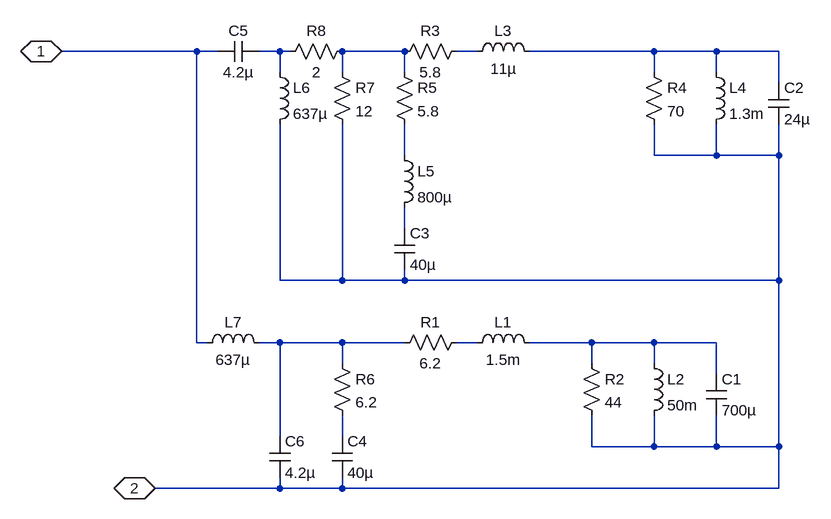
[diagram p0: schematic model_2way_speaker.asc]
model_2way_speaker.asc, the LTspice schematic file:
Version 4
SHEET 1 880 680
WIRE -544 -256 -752 -256
WIRE -512 -256 -544 -256
WIRE -416 -256 -448 -256
WIRE -400 -256 -416 -256
WIRE -224 -256 -320 -256
WIRE -112 -256 -144 -256
WIRE 160 -256 -32 -256
WIRE 256 -256 160 -256
WIRE 352 -256 256 -256
WIRE -416 -224 -416 -256
WIRE -320 -224 -320 -256
WIRE -224 -224 -224 -256
WIRE 160 -224 160 -256
WIRE 256 -224 256 -256
WIRE 352 -208 352 -256
WIRE -224 -96 -224 -144
WIRE 160 -96 160 -144
WIRE 256 -96 256 -144
WIRE 256 -96 160 -96
WIRE 352 -96 352 -144
WIRE 352 -96 256 -96
WIRE -224 16 -224 -16
WIRE -416 96 -416 -144
WIRE -320 96 -320 -144
WIRE -320 96 -416 96
WIRE -224 96 -224 80
WIRE -224 96 -320 96
WIRE 352 96 352 -96
WIRE 352 96 -224 96
WIRE -544 192 -544 -256
WIRE -528 192 -544 192
WIRE -416 192 -448 192
WIRE -320 192 -416 192
WIRE -224 192 -320 192
WIRE -112 192 -144 192
WIRE 64 192 -32 192
WIRE 160 192 64 192
WIRE 256 192 160 192
WIRE -320 224 -320 192
WIRE 64 224 64 192
WIRE 160 224 160 192
WIRE 256 240 256 192
WIRE -416 336 -416 192
WIRE -320 336 -320 304
WIRE 64 352 64 304
WIRE 160 352 160 304
WIRE 160 352 64 352
WIRE 256 352 256 304
WIRE 256 352 160 352
WIRE 352 352 352 96
WIRE 352 352 256 352
WIRE -416 416 -416 400
WIRE -416 416 -608 416
WIRE -320 416 -320 400
WIRE -320 416 -416 416
WIRE 352 416 352 352
WIRE 352 416 -320 416
FLAG -752 -256 1
IOPIN -752 -256 BiDir
FLAG -608 416 2
IOPIN -608 416 BiDir
SYMBOL res -128 176 R90
WINDOW 0 0 56 VBottom 0
WINDOW 3 32 56 VTop 0
SYMATTR InstName R1
SYMATTR Value 6.2
SYMBOL ind -128 208 R270
WINDOW 0 32 56 VTop 0
WINDOW 3 5 56 VBottom 0
SYMATTR InstName L1
SYMATTR Value 1.5m
SYMBOL res 48 208 R0
SYMATTR InstName R2
SYMATTR Value 44
SYMBOL ind 144 208 R0
SYMATTR InstName L2
SYMATTR Value 50m
SYMBOL cap 240 240 R0
SYMATTR InstName C1
SYMATTR Value 700µ
SYMBOL res -128 -272 R90
WINDOW 0 0 56 VBottom 0
WINDOW 3 32 56 VTop 0
SYMATTR InstName R3
SYMATTR Value 5.8
SYMBOL ind -128 -240 R270
WINDOW 0 32 56 VTop 0
WINDOW 3 5 56 VBottom 0
SYMATTR InstName L3
SYMATTR Value 11µ
SYMBOL res 144 -240 R0
SYMATTR InstName R4
SYMATTR Value 70
SYMBOL ind 240 -240 R0
SYMATTR InstName L4
SYMATTR Value 1.3m
SYMBOL cap 336 -208 R0
SYMATTR InstName C2
SYMATTR Value 24µ
SYMBOL ind -432 -240 R0
SYMATTR InstName L6
SYMATTR Value 637µ
SYMBOL cap -448 -272 R90
WINDOW 0 0 32 VBottom 0
WINDOW 3 32 32 VTop 0
SYMATTR InstName C5
SYMATTR Value 4.2µ
SYMBOL ind -544 208 R270
WINDOW 0 32 56 VTop 0
WINDOW 3 5 56 VBottom 0
SYMATTR InstName L7
SYMATTR Value 637µ
SYMBOL cap -432 336 R0
SYMATTR InstName C6
SYMATTR Value 4.2µ
SYMBOL res -336 -240 R0
SYMATTR InstName R7
SYMATTR Value 12
SYMBOL res -416 -240 R270
WINDOW 0 32 56 VTop 0
WINDOW 3 0 56 VBottom 0
SYMATTR InstName R8
SYMATTR Value 2
SYMBOL res -240 -240 R0
SYMATTR InstName R5
SYMATTR Value 5.8
SYMBOL ind -240 -112 R0
SYMATTR InstName L5
SYMATTR Value 800µ
SYMBOL cap -240 16 R0
SYMATTR InstName C3
SYMATTR Value 40µ
SYMBOL res -336 208 R0
SYMATTR InstName R6
SYMATTR Value 6.2
SYMBOL cap -336 336 R0
SYMATTR InstName C4
SYMATTR Value 40µ

The netlist it stands for:
* model_2way_speaker.asc
R1 N008 N007 6.2
L1 N008 N009 1.5m
R2 N009 2 44
L2 N009 2 50m
C1 N009 2 700µ
R3 N003 N002 5.8
L3 N003 N004 11µ
R4 N004 2 70
L4 N004 2 1.3m
C2 N004 2 24µ
L6 N001 2 637µ
C5 N001 1 4.2µ
L7 1 N007 637µ
C6 N007 2 4.2µ
R7 N002 2 12
R8 N001 N002 2
R5 N002 N005 5.8
L5 N005 N006 800µ
C3 N006 2 40µ
R6 N007 N010 6.2
C4 N010 2 40µ
.backanno
.end